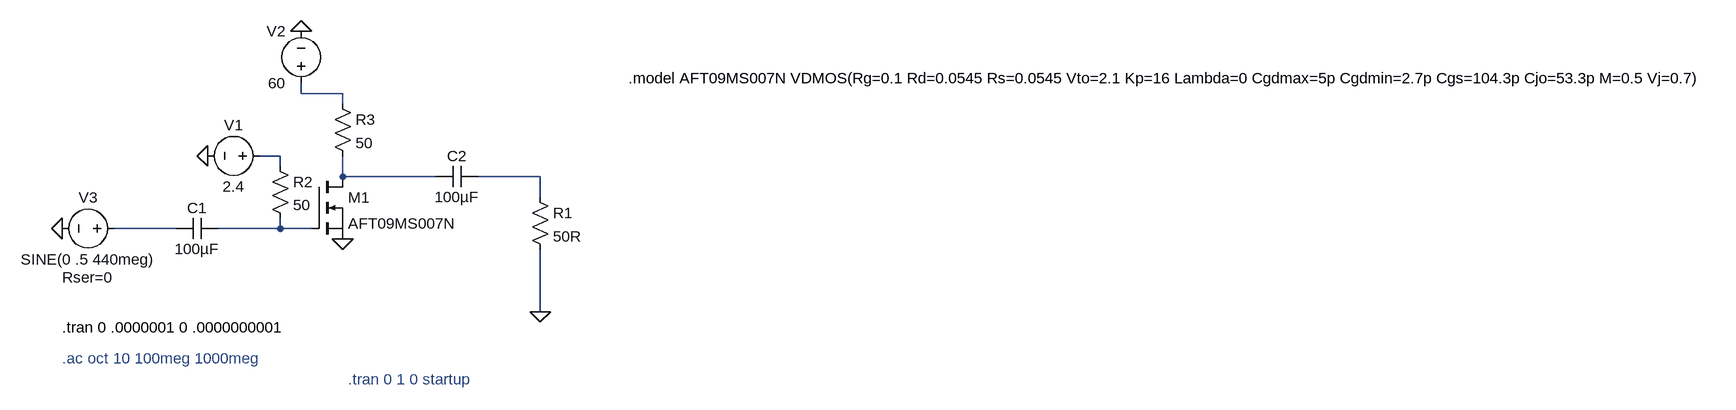
[diagram p0: schematic MOSFET RF front end amplifier.asc]
MOSFET RF front end amplifier.asc, the LTspice schematic file:
Version 4.1
SHEET 1 4972 680
WIRE 176 16 176 0
WIRE 240 16 176 16
WIRE 240 32 240 16
WIRE 144 112 112 112
WIRE 144 128 144 112
WIRE 240 144 240 112
WIRE 384 144 240 144
WIRE 544 144 448 144
WIRE 544 176 544 144
WIRE -16 224 -112 224
WIRE 144 224 144 208
WIRE 144 224 48 224
WIRE 192 224 144 224
WIRE 544 352 544 256
FLAG 544 352 0
FLAG 176 -80 0
FLAG 32 112 0
FLAG 240 240 0
FLAG -192 224 0
SYMBOL nmos 192 144 R0
SYMATTR InstName M1
SYMATTR Value AFT09MS007N
SYMBOL voltage 176 16 R180
WINDOW 0 24 96 Left 2
WINDOW 3 24 16 Left 2
WINDOW 123 0 0 Left 0
WINDOW 39 0 0 Left 0
SYMATTR InstName V2
SYMATTR Value 60
SYMBOL cap -16 208 M90
WINDOW 0 0 32 VBottom 2
WINDOW 3 32 32 VTop 2
SYMATTR InstName C1
SYMATTR Value 100µF
SYMBOL cap 384 160 R270
WINDOW 0 32 32 VTop 2
WINDOW 3 0 32 VBottom 2
SYMATTR InstName C2
SYMATTR Value 100µF
SYMBOL res 528 160 R0
SYMATTR InstName R1
SYMATTR Value 50R
SYMBOL res 224 16 R0
SYMATTR InstName R3
SYMATTR Value 50
SYMBOL voltage 128 112 R90
WINDOW 0 -32 56 VBottom 2
WINDOW 3 32 56 VTop 2
WINDOW 123 0 0 Left 0
WINDOW 39 0 0 Left 0
SYMATTR InstName V1
SYMATTR Value 2.4
SYMBOL res 128 112 R0
SYMATTR InstName R2
SYMATTR Value 50
SYMBOL voltage -96 224 R90
WINDOW 0 -32 56 VBottom 2
WINDOW 3 32 56 VTop 2
WINDOW 123 0 0 Left 0
WINDOW 39 60 56 VTop 2
SYMATTR InstName V3
SYMATTR Value SINE(0 .5 440meg)
SYMATTR SpiceLine Rser=0
TEXT -192 376 Left 2 !.tran 0 .0000001 0 .0000000001
TEXT 680 -8 Left 2 !.model AFT09MS007N VDMOS(Rg=0.1 Rd=0.0545 Rs=0.0545 Vto=2.1 Kp=16 Lambda=0 Cgdmax=5p Cgdmin=2.7p Cgs=104.3p Cjo=53.3p M=0.5 Vj=0.7)
TEXT -192 424 Left 2 ;.ac oct 10 100meg 1000meg
TEXT 248 456 Left 2 ;.tran 0 1 0 startup

The netlist it stands for:
* MOSFET RF front end amplifier.asc
M1 N003 N006 0 0 AFT09MS007N
V2 N001 0 60
C1 N005 N006 100µF
C2 N003 N004 100µF
R1 N004 0 50R
R3 N001 N003 50
V1 N002 0 2.4
R2 N002 N006 50
V3 N005 0 SINE(0 .5 440meg) Rser=0
.model NMOS NMOS
.model PMOS PMOS
.lib standard.mos
.tran 0 .0000001 0 .0000000001
.model AFT09MS007N VDMOS(Rg=0.1 Rd=0.0545 Rs=0.0545 Vto=2.1 Kp=16 Lambda=0 Cgdmax=5p Cgdmin=2.7p Cgs=104.3p Cjo=53.3p M=0.5 Vj=0.7)
* .ac oct 10 100meg 1000meg
* .tran 0 1 0 startup
.backanno
.end